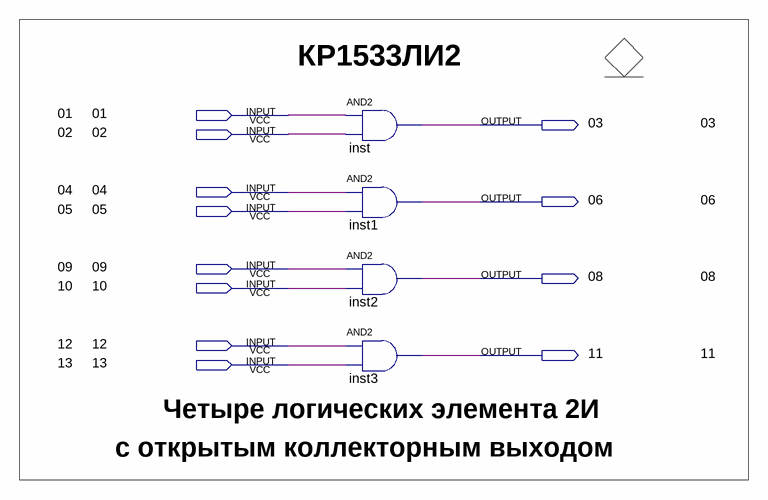
[diagram p0: schematic sheet]
// Quartus schematic KP1533LI2.bdf as structural Verilog: 4 symbols, 12 pins
module KP1533LI2 (
  input  \01 ,
  input  \02 ,
  input  \04 ,
  input  \05 ,
  input  \09 ,
  input  \10 ,
  input  \12 ,
  input  \13 ,
  output \03 ,
  output \06 ,
  output \08 ,
  output \11 
);

  and inst (\03 , \01 , \02 );
  and inst1 (\06 , \04 , \05 );
  and inst2 (\08 , \09 , \10 );
  and inst3 (\11 , \12 , \13 );

  // Notes on the sheet:
  //   КР1533ЛИ2
  //   01
  //   03
  //   02
  //   04
  //   06
  //   05
  //   09
  //   08
  //   10
  //   12
  //   11
  //   13
  //   Четыре логических элемента 2И
  //   с открытым коллекторным выходом
endmodule
